# EAGLE schematic RaspiSmoopiShield v11 (EAGLE 9.7.0)
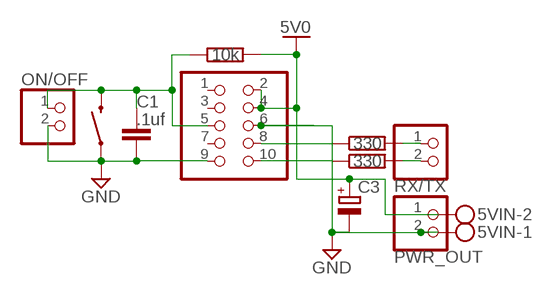
[diagram p0: schematic, sheet 1]

## Parts
5VIN  MKDSN1,5/2-5,08  [MKDSN1,5/2-5,08]
C1  .1uf  C_CHIP-0805(2012-METRIC)  [CAPC2012X110]
C3  C-POL_ECAP-8.5MM  [CAPAE830X1050N]
JP4  PINHD-2X5  [2X05]
ON/OFF  PINHD-1X2  [1X02]
PWR_OUT  PINHD-1X2  [1X02]
R1  330  R_CHIP-0805(2012-METRIC)  [RESC2012X65]
R2  330  R_CHIP-0805(2012-METRIC)  [RESC2012X65]
R3  10k  R_CHIP-0603(1608-METRIC)  [RESC1608X60]
RST_BUT  MOMENTARY-SWITCH-SPST-SMD-5.2MM  [TACTILE_SWITCH_SMD_5.2MM]
RX/TX  PINHD-1X2  [1X02]

## Nets
5V0: 5VIN.2 C3.1(+) JP4.2 JP4.4 PWR_OUT.1 R3.2
GND: 5VIN.1 C1.2 C3.2(-) JP4.6 JP4.9 ON/OFF.2 PWR_OUT.2 RST_BUT.1
N$1: JP4.8 R1.1
N$2: R1.2 RX/TX.1
N$3: C1.1 JP4.5 ON/OFF.1 R3.1 RST_BUT.3
N$4: JP4.10 R2.1
N$6: R2.2 RX/TX.2
Unconnected: JP4.1 JP4.3 JP4.7

## Library data of the parts
5VIN = con-phoenix-508:MKDSN1,5/2-5,08: MKDSN 1,5/ 2-5,08 Printklemme Nennstrom: 13,5 A Nennspannung: 250 V Rastermaß: 5,08 mm Polzahl: 2 Anschlussart: Schraubanschluss Montage: Löten Anschlussrichtung Leiter/Platine: 0 ° Artikelnummer: 1729128 Source: http://eshop.phoenixcontact.com .. 1729128.pdf
C1 = Capacitor:C: Capacitor - Generic; CATEGORY: Capacitor
C3 = Capacitor:C-POL: Capacitor Polarised - Generic; CATEGORY: Capacitor
JP4 = Connector:PINHD-2X5: PIN HEADER; CATEGORY: CONNECTOR; SUB-CATEGORY: PIN-HEADER
ON/OFF PWR_OUT RX/TX = Connector:PINHD-1X2: PIN HEADER; CATEGORY: CONNECTOR; SUB-CATEGORY: PIN-HEADER
R1-R3 = Resistor:R: Resistor Fixed - Generic; CATEGORY: Resistor; SUB-CATEGORY: Fixed
RST_BUT = SparkFun-Switches:MOMENTARY-SWITCH-SPST: Momentary Switch (Pushbutton) - SPST Normally-open (NO) SPST momentary switches (buttons, pushbuttons). Variants PTH-12MM - 12mm square, through-hole Momentary Pushbutton Switch - 12mm Square <https://www.sparkfun.com/products/9190> (COM-09190) PTH-6.0MM, PTH-6.0MM-KIT - 6.0mm square, through-hole Mini Pushbutton Switch <https://www.sparkfun.com/products/97> (COM-00097) KIT package intended for soldering kit's - only one side of pads' copper is exposed. PTH-RIGHT-ANGLE-KIT - Right-angle, through-hole Right Angle Tactile Button <https://www.sparkfun.com/products/10791> - Used on SparkFun BigTime Watch Kit <https://www.sparkfun.com/products/11734> SMD-12MM - 12mm square, surface-mount Tactile Button - SMD (12mm) <https://www.sparkfun.com/products/12993> (COM-12993) Used on SparkFun PicoBoard <https://www.sparkfun.com/products/11888> SMD-4.5MM - 4.5mm Square Trackball Switch Used on SparkFun Blackberry Trackballer Breakout <https://www.sparkfun.com/products/13169> SMD-4.6MMX2.8MM - 4.60mm x 2.80mm, surface mount Used on SparkFun SAMD21 Mini Breakout <https://www.sparkfun.com/products/13664> SMD-5.2MM, SMD-5.2-REDUNDANT - 5.2mm square, surface-mount Mini Pushbutton Switch - SMD <https://www.sparkfun.com/products/8720> (COM-08720) Used on Arduino Pro Mini <https://www.sparkfun.com/products/11114> REDUNDANT package connects both switch circuits together SMD-6.0X3.5MM - 6.0 x 3.5mm, surface mount Momentary Reset Switch SMD <https://www.sparkfun.com/products/8229> (COM-08229) SMD-6.2MM-TALL - 6.2mm square, surface mount Tactile Button - SMD (6mm) <https://www.sparkfun.com/products/12992> Used on SparkFun Digital Sandbox <https://www.sparkfun.com/products/12651> SMD-RIGHT-ANGLE - Right-angle, surface mount Used on SparkFun Block for Intel® Edison - Arduino <https://www.sparkfun.com/products/13036>; PROD_ID: SWCH-08247; SF_SKU: COM-08720